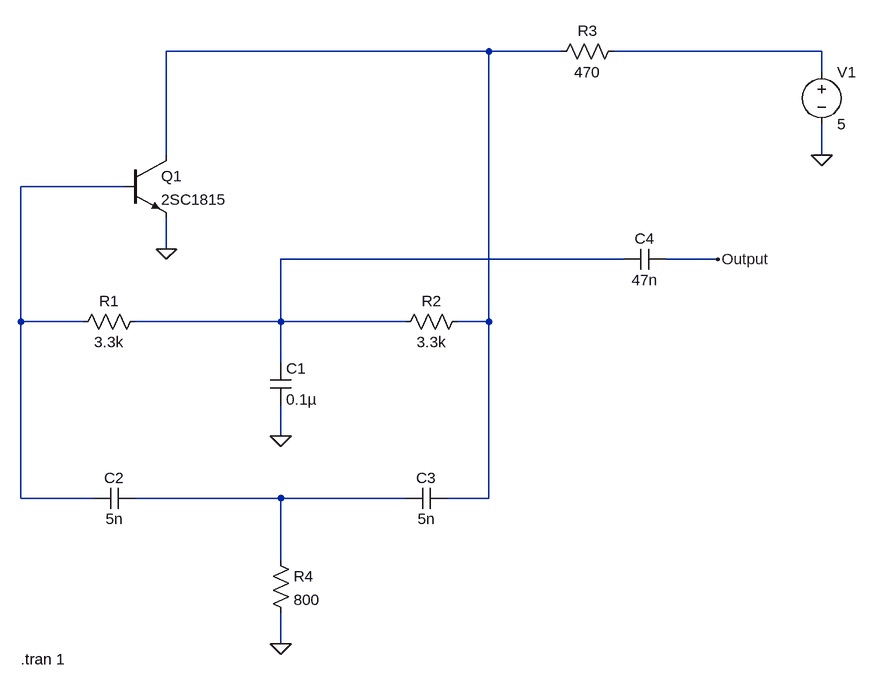
[diagram p0: schematic Twin-T-Oscillator.asc]
Twin-T-Oscillator.asc, the LTspice schematic file:
Version 4
SHEET 1 952 904
WIRE 384 -48 -112 -48
WIRE 496 -48 384 -48
WIRE 896 -48 576 -48
WIRE 896 -16 896 -48
WIRE -112 112 -112 -48
WIRE 896 112 896 64
WIRE -176 160 -336 160
WIRE -112 256 -112 208
WIRE 592 272 64 272
WIRE 736 272 656 272
WIRE -336 368 -336 160
WIRE -240 368 -336 368
WIRE 64 368 64 272
WIRE 64 368 -160 368
WIRE 256 368 64 368
WIRE 384 368 384 -48
WIRE 384 368 336 368
WIRE 64 432 64 368
WIRE 64 544 64 496
WIRE -336 640 -336 368
WIRE -224 640 -336 640
WIRE 64 640 -160 640
WIRE 256 640 64 640
WIRE 384 640 384 368
WIRE 384 640 320 640
WIRE 64 736 64 640
WIRE 64 864 64 816
FLAG -112 256 0
FLAG 64 544 0
FLAG 64 864 0
FLAG 896 112 0
FLAG 736 272 Output
SYMBOL npn -176 112 R0
SYMATTR InstName Q1
SYMATTR Value 2SC1815
SYMBOL res -144 352 R90
WINDOW 0 0 56 VBottom 2
WINDOW 3 32 56 VTop 2
SYMATTR InstName R1
SYMATTR Value 3.3k
SYMBOL res 352 352 R90
WINDOW 0 0 56 VBottom 2
WINDOW 3 32 56 VTop 2
SYMATTR InstName R2
SYMATTR Value 3.3k
SYMBOL res 592 -64 R90
WINDOW 0 0 56 VBottom 2
WINDOW 3 32 56 VTop 2
SYMATTR InstName R3
SYMATTR Value 470
SYMBOL res 48 720 R0
SYMATTR InstName R4
SYMATTR Value 800
SYMBOL cap 48 432 R0
SYMATTR InstName C1
SYMATTR Value 0.1µ
SYMBOL cap -160 624 R90
WINDOW 0 0 32 VBottom 2
WINDOW 3 32 32 VTop 2
SYMATTR InstName C2
SYMATTR Value 5n
SYMBOL cap 320 624 R90
WINDOW 0 0 32 VBottom 2
WINDOW 3 32 32 VTop 2
SYMATTR InstName C3
SYMATTR Value 5n
SYMBOL cap 656 256 R90
WINDOW 0 0 32 VBottom 2
WINDOW 3 32 32 VTop 2
SYMATTR InstName C4
SYMATTR Value 47n
SYMBOL voltage 896 -32 R0
WINDOW 123 0 0 Left 0
WINDOW 39 0 0 Left 0
SYMATTR InstName V1
SYMATTR Value 5
TEXT -336 888 Left 2 !.tran 1

The netlist it stands for:
* Twin-T-Oscillator.asc
Q1 N001 N003 0 0 2SC1815
R1 N004 N003 3.3k
R2 N001 N004 3.3k
R3 N002 N001 470
R4 N005 0 800
C1 N004 0 0.1µ
C2 N005 N003 5n
C3 N001 N005 5n
C4 Output N004 47n
V1 N002 0 5
.model NPN NPN
.model PNP PNP
.lib standard.bjt
.tran 1
.backanno
.end